# Altium schematic sheet Sheet1.SchDoc
size A2
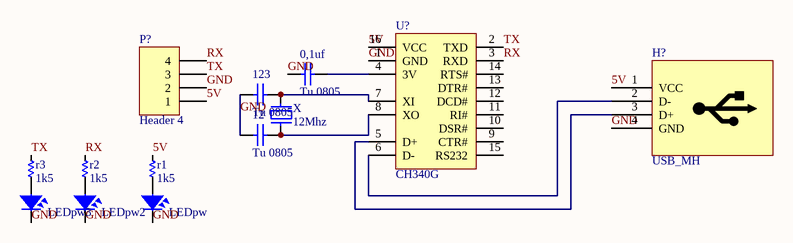
[diagram p0: Sheet1.SchDoc]

## Parts
0,1uf  Tu 0805  [Tu 0805]
12  Tu 0805  [Tu 0805]
123  Tu 0805  [Tu 0805]
H?  USB_MH  [USB-A-RA]
LEDpw  LED  [LED-0805-Blue]  (value not drawn)
LEDpw2  LED  [LED-0805-Green]  (value not drawn)
LEDpw3  LED  [LED-0805-Orange]  (value not drawn)
P?  Header 4  [HDR1X4]
r1  1k5  [RES-SMD-0805]
r2  1k5  [RES-SMD-0805]
r3  1k5  [RES-SMD-1206]
U?  CH340G  [SO16]
X  12Mhz  [XT2-SMD]

## Nets
5V: H?.1(VCC) P?.1 r1.2 U?.16(VCC)
GND: 0,1uf.2 12.2 123.2 H?.4(GND) LEDpw.2 LEDpw2.2 LEDpw3.2 P?.2 U?.1(GND)
RX: P?.4 r2.2 U?.3(RXD)
TX: P?.3 r3.2 U?.2(TXD)
Net0,1uf_1: 0,1uf.1 U?.4(3V)
Net12_1: 12.1 U?.8(XO) X.1
Net123_1: 123.1 U?.7(XI) X.2
NetH?_2: H?.2(D-) U?.6(D-)
NetH?_3: H?.3(D+) U?.5(D+)
NetLEDpw2_1: LEDpw2.1 r2.1
NetLEDpw3_1: LEDpw3.1 r3.1
NetLEDpw_1: LEDpw.1 r1.1

Not connected (* = marked no-connect by the designer): H? 5 6; U? 9(CTR#) 10(DSR#) 11(RI#) 12(DCD#) 13(DTR#) 14(RTS#) 15(RS232)

## Notes on the sheet
- Title
- Size:
- Date:
- File:
- A2
- Number:
- Time:
- Revision:
- Sheet
- of

## Library data of the parts
0,1uf 12 123 = CAP 0805
H? = USB_MH: USB conector
LEDpw LEDpw2 LEDpw3 = LED SMD: Value: LED 3 - 5 ly 2 Colour
P? = Header 4: Header, 4-Pin; LatestRevisionDate: 17-Jul-2002; LatestRevisionNote: Re-released for DXP Platform.; Publisher: Altium Limited
r1-r3 = Res-SMD: Resistor; Manufacturer: Generic Components; Class: Passive; Published: 08/06/2000; Publisher: Altium Hobart Technology Centre
U? = CH340G: High and Low Side Driver; Note: Pins 4, 8 and 14 are not connected; Published: 8-Jun-2000; LatestRevisionDate: 04-Mar-2005; LatestRevisionNote: Stylized 3D Model Added.; DatasheetVersion: PD60147J; PackageReference: PDIP14; Publisher: Altium Limited; PackageDescription: DIP; 14 Leads; Row Spacing 7.62 mm; Pitch 2.54 mm; ComponentLink1Description: Manufacturer Link; ComponentLink1URL: http://www.irf.com/; ComponentLink2Description: Datasheet; ComponentLink2URL: http://www.irf.com/product-info/datasheets/data/ir2110.pdf
X = XT2: Crystal, 32.768 KHz, -40 to 85 degC, 3.2 x 1.5 x 0.9 mm SMD; Value: 4Mhz